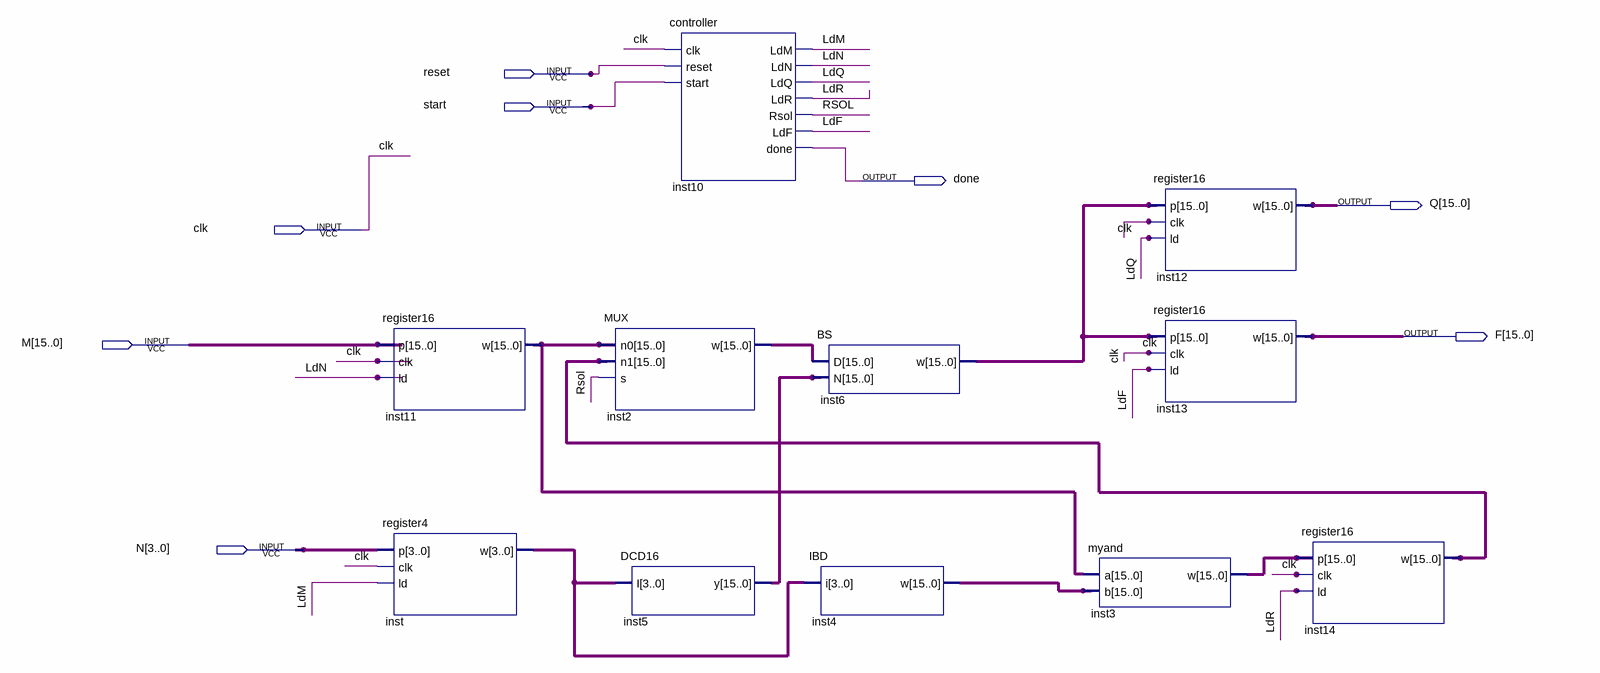
[diagram p0: schematic sheet]
// Quartus schematic Datapath.bdf as structural Verilog: 11 symbols, 8 pins
module Datapath (
  input  reset,
  input  start,
  input  clk,
  input  [15:0] M,
  input  [3:0] N,
  output done,
  output [15:0] Q,
  output [15:0] F
);

  wire LdF, LdM, LdN, LdQ, LdR, RSOL;
  wire [3:0] inst_w;
  wire [15:0] inst2_w, inst3_w, inst4_w, inst5_y, inst6_w, inst11_w, inst14_w;

  register16 inst11 (.p(M), .clk(clk), .ld(LdN), .w(inst11_w));
  register4 inst (.p(N), .clk(clk), .ld(LdM), .w(inst_w));
  MUX inst2 (.n0(inst11_w), .n1(inst14_w), .s(RSOL), .w(inst2_w));
  DCD16 inst5 (.I(inst_w), .y(inst5_y));
  controller inst10 (
    .clk(clk), .reset(reset), .start(start), .LdM(LdM), .LdN(LdN), .LdQ(LdQ), .LdR(LdR), .Rsol(RSOL),
    .LdF(LdF), .done(done));
  BS inst6 (.D(inst2_w), .N(inst5_y), .w(inst6_w));
  IBD inst4 (.i(inst_w), .w(inst4_w));
  myand inst3 (.a(inst11_w), .b(inst4_w), .w(inst3_w));
  register16 inst12 (.p(inst6_w), .clk(clk), .ld(LdQ), .w(Q));
  register16 inst13 (.p(inst6_w), .clk(clk), .ld(LdF), .w(F));
  register16 inst14 (.p(inst3_w), .clk(clk), .ld(LdR), .w(inst14_w));
endmodule
